# EAGLE design Patch panel module - Insert (EAGLE 7.2.0)
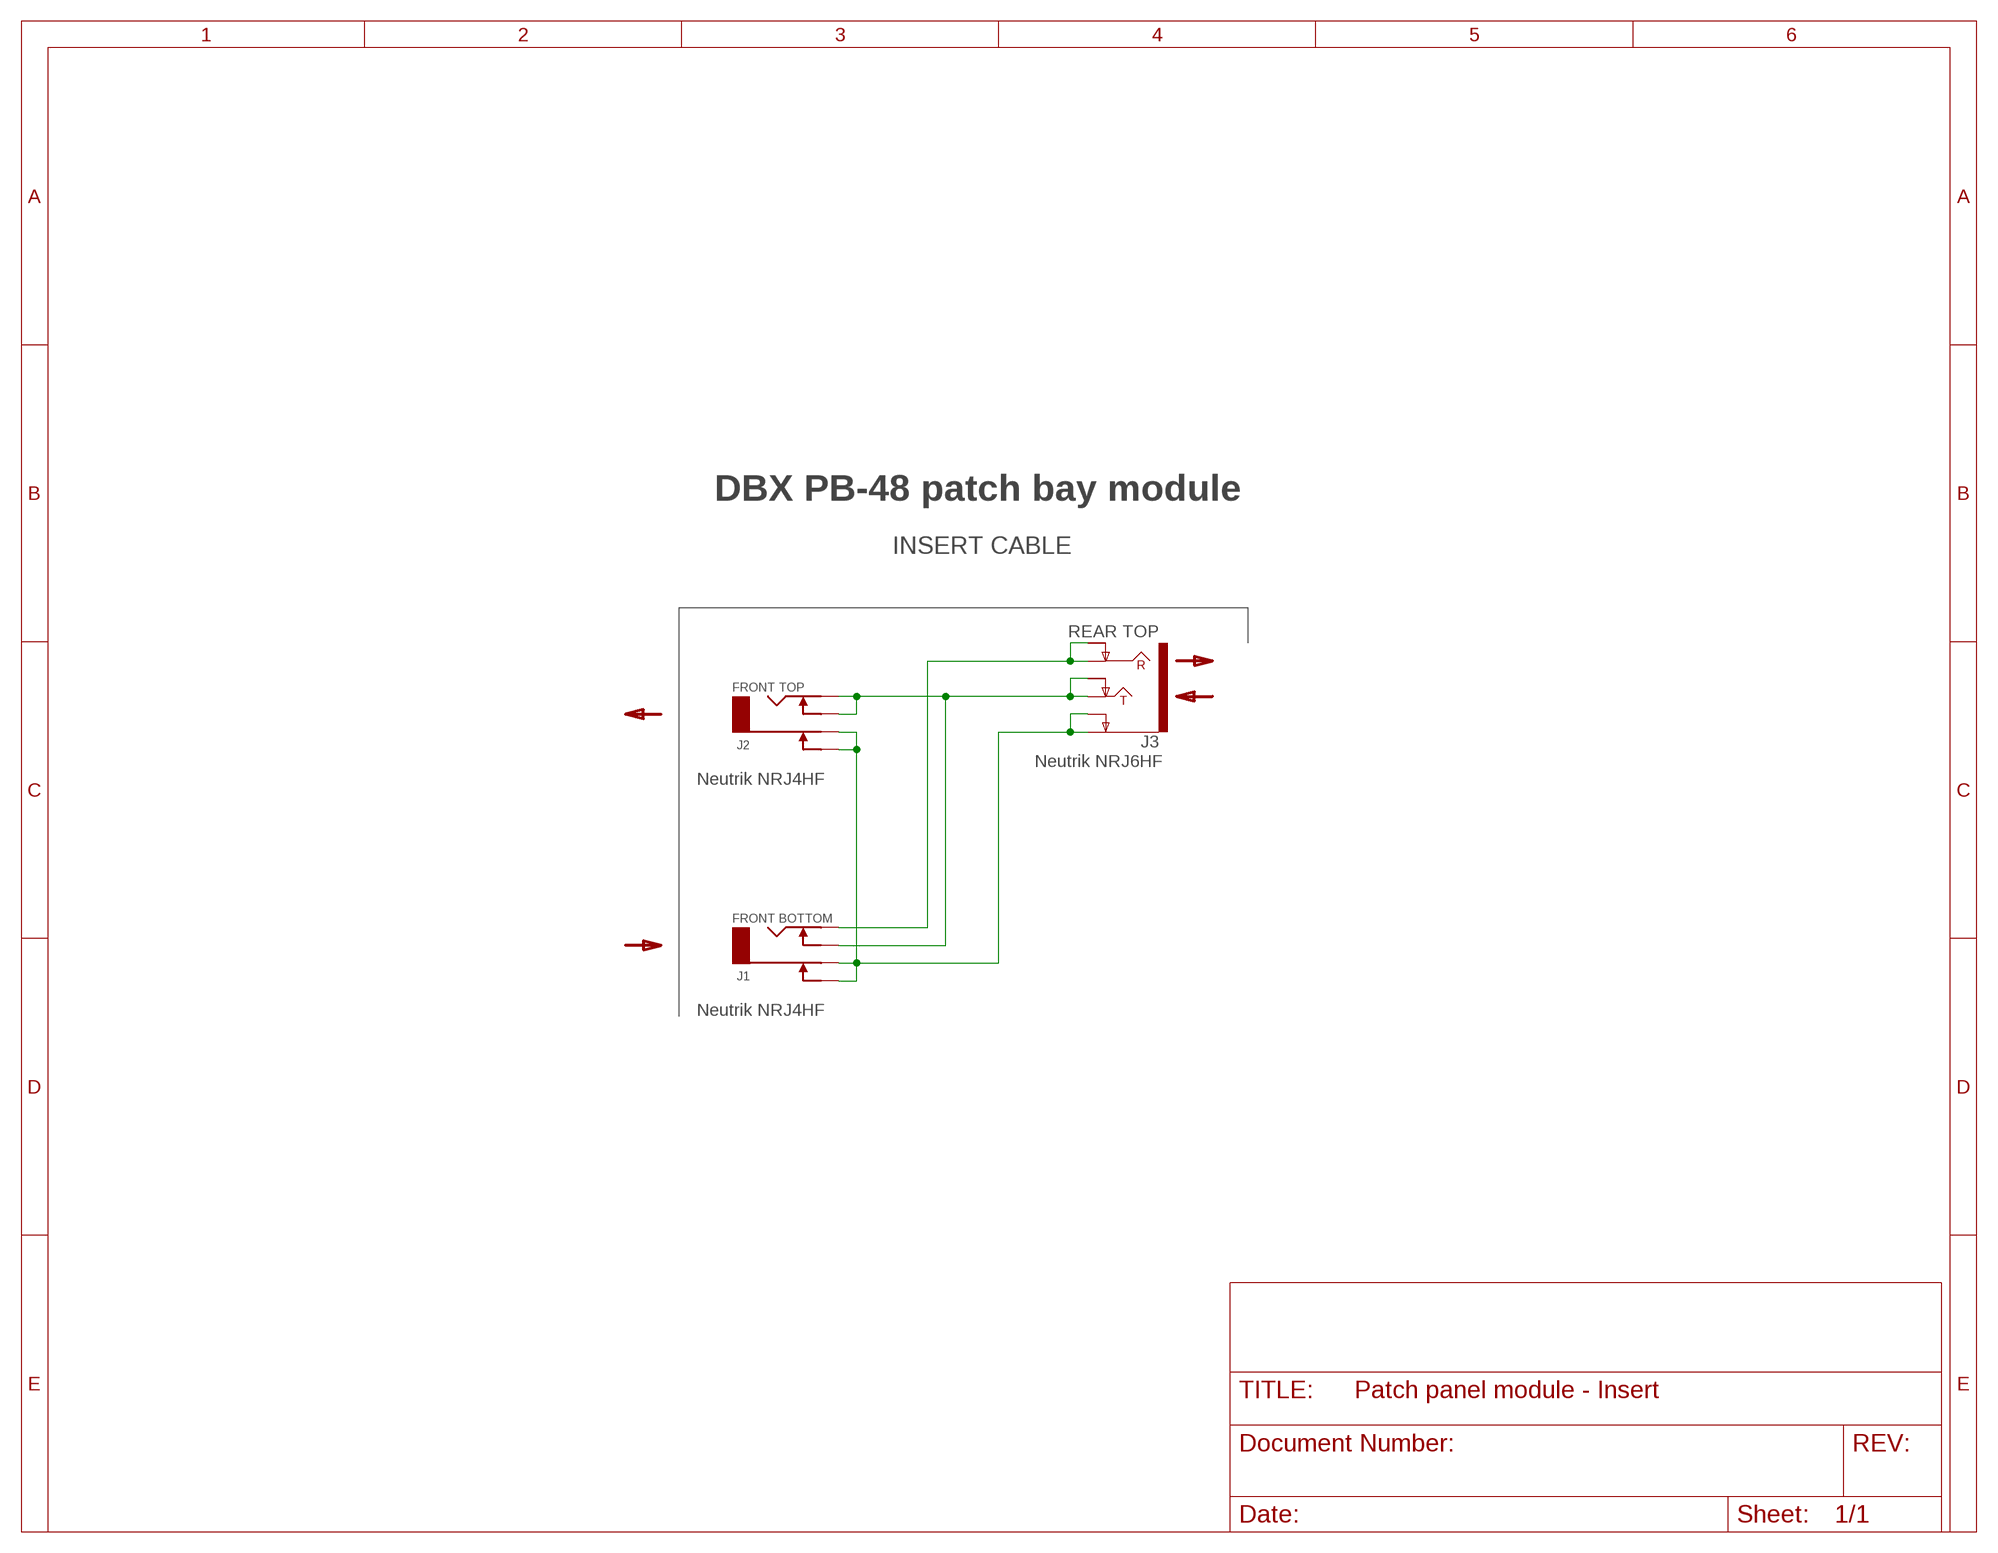
[diagram p0: schematic, sheet 1]

## Parts
J1  FRONT BOTTOM  JACK-TS-SW-2X  [NEUTRIK-NRJ4HF]
J2  FRONT TOP  JACK-TS-SW-2X  [NEUTRIK-NRJ4HF]
J3  REAR TOP  AUDIO_JACK_TRS_0.25"_PTH_RA-NRJ6HM  [NEUTRIK-NRJ6HF]

## Nets
N$1: J1.TN J2.T(TIP) J2.TN J3.T(TIP) J3.TN(TIP-NORM)
N$2: J1.T(TIP) J3.R(RING) J3.RN(RING-NORM)
N$6: J1.S(SLEEVE) J1.SN J2.S(SLEEVE) J2.SN J3.S(EARTH) J3.SN(EARTH-NORM)

## Notes on the sheet
- DBX PB-48 patch bay module
- INSERT CABLE
- Neutrik NRJ6HF
- Neutrik NRJ4HF
- Neutrik NRJ4HF

## Library data of the parts
J1 J2 = !frankendeck:JACK-TS-SW-2X
J3 = !frankendeck:AUDIO_JACK_TRS_0.25"_PTH_RA: Audio Jack, 1/4" TRS jack, horizontal, PTH, aka "Phono jack" Find the connector here: Audio Jack - 1/4" Stereo (right angle) <https://www.sparkfun.com/products/11144> (COM-11144) Datasheet <http://cdn.sparkfun.com/datasheets/Components/General/JP-611%20DD.jpg> Note, although the datasheet and physical part are slightly different, this footprint was proven to mate well on the Proto Pedal. This device is used on these SparkFun Products: SparkFun TRS Jack Breakout - 1/4" Stereo <https://www.sparkfun.com/products/13005> (BOB-13005 ) SparkFun Proto Pedal - sorry bad link - product comming soon! <https://www.sparkfun.com/products/13124> (PRT-13124); PROD_ID: CONN-12339; SF_ID: COM-11144

## Board
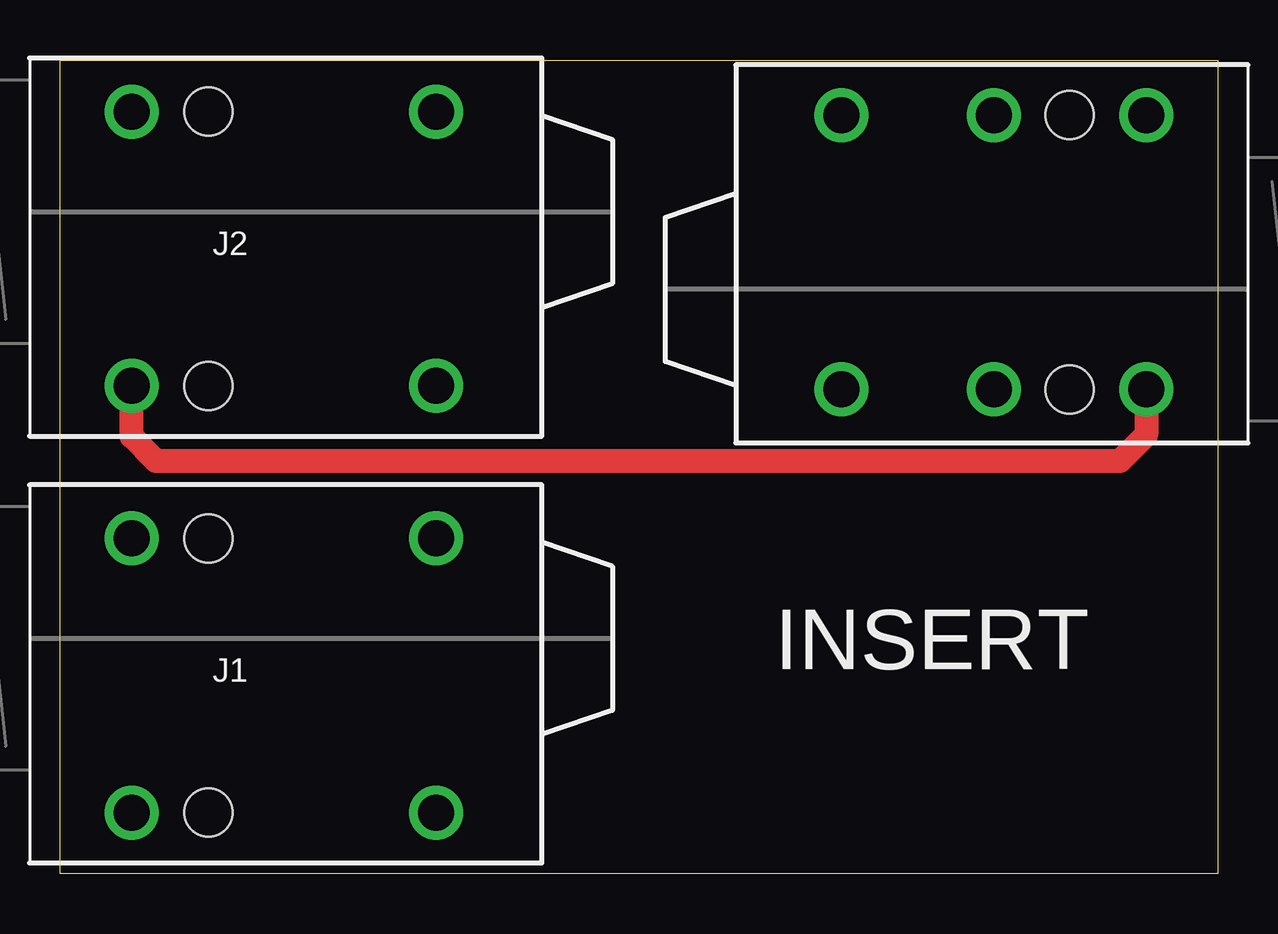
[diagram p1: board, top side]
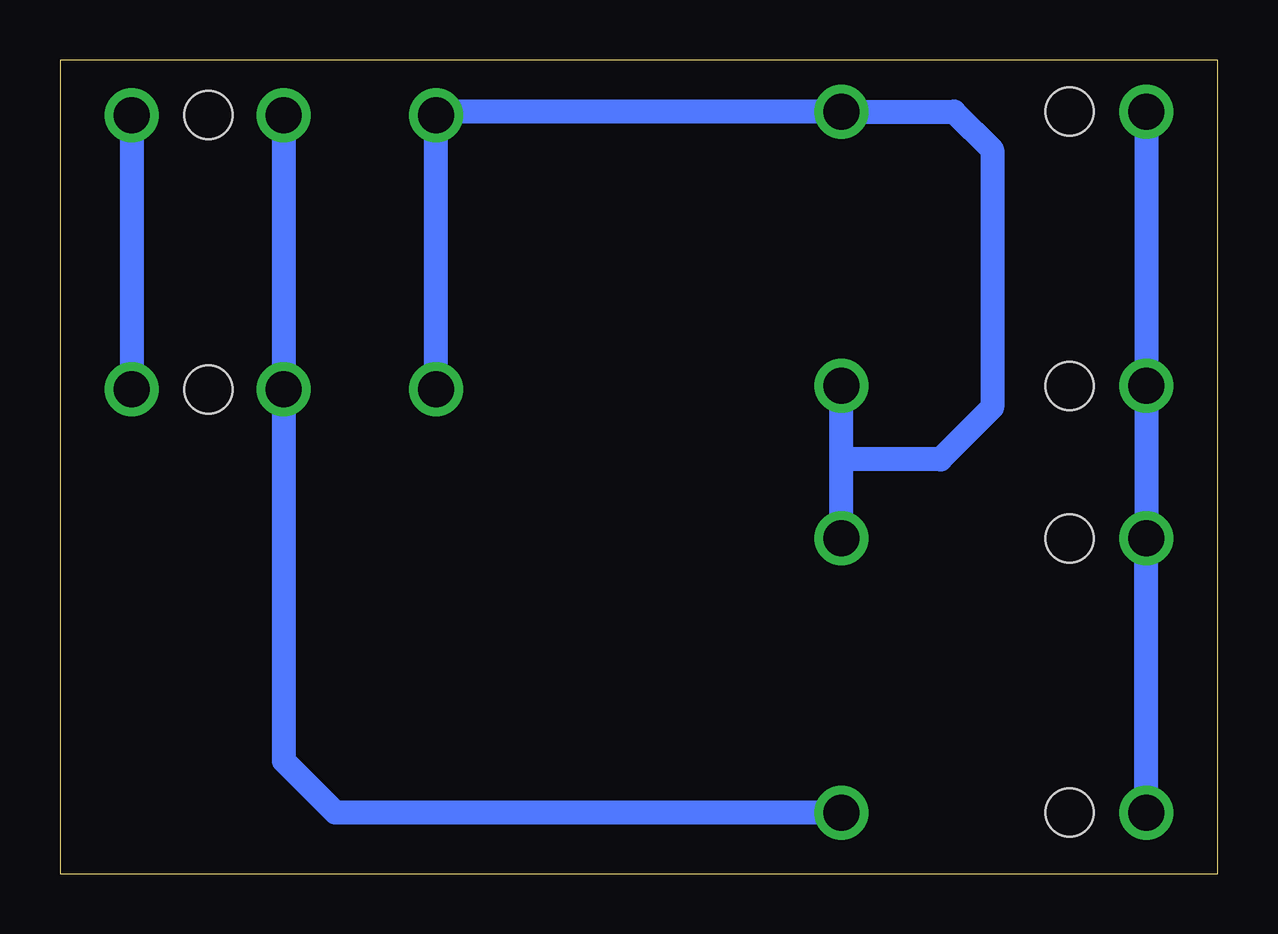
[diagram p2: board, bottom side, seen from below]

Size 48.26 x 33.91 mm. Coordinates in mm from the lower left corner, seen from the top.
Outline: 0,33.91 48.26,33.91 48.26,0 0,0 0,33.91
Copper layers (1*16): Top 0.035559375mm / dielectric 1.6mm / Bottom 0.035559375mm
Design rules "jlcpcb2layer": minimum track width 5mil, minimum drill 12mil, track to track 5mil, track to pad 5mil, pad to pad 5mil, via to via 5mil, smd to smd 5mil, copper to edge 8mil, drill to drill 6mil, minimum pad ring 5mil, minimum via ring 3mil, stop-mask expansion 2.5mil, vias tented up to drill 15mil, thermal gap 10mil

### Footprints (pad centres in the part's own frame; a part is rotated, then mirrored left to right if it is on the bottom)
NEUTRIK-NRJ4HF = drill 1.5: S -4.25,7.23; SN -4.25,-4.2; T -16.95,7.23; TN -16.95,-4.2 | hole 2: -7.45,-4.2; -7.45,7.23
NEUTRIK-NRJ6HF = drill 1.5: R -10.6,7.23; RN -10.6,-4.2; S -4.25,7.23; SN -4.25,-4.2; T -16.95,7.23; TN -16.95,-4.2 | hole 2: -7.45,7.23; -7.45,-4.2

### Placement (x,y rotation side)
J1  -1.27,9.78 180 top
J2  -1.27,27.56 180 top
J3  49.53,24.38 0 top

### Tracks (layer width: path | path; a pad name or v marks a point on that pad's centre or on a via)
N$1
  Bottom 1: J1.TN 15.68,17.21 | 15.68,17.21 J2.T | 15.68,17.21 15.62,17.27 11.56,17.27 9.4,19.43 9.4,30.16 10.99,31.76 J2.TN 32.44,31.76 J3.T J3.TN
N$2
  Bottom 1: J3.R J3.RN 38.93,4.7 36.78,2.55 J1.T
N$6
  Top 1: J2.S 2.98,18.22 4,17.21 44.2,17.21 45.28,18.29 J3.SN
  Bottom 1: J2.SN J2.S J1.SN J1.S | J3.S J3.SN

### Text on the board
tPlace: INSERT